# EAGLE design converter in (EAGLE 7.6.0)
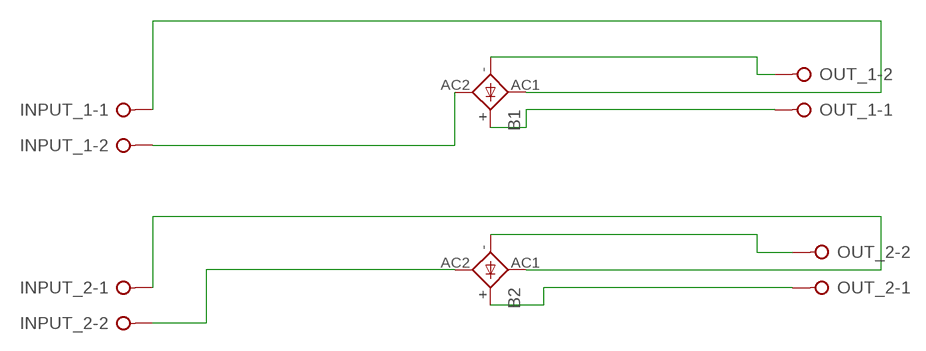
[diagram p0: schematic, sheet 1]

## Parts
B1  2KBP  [2KBP]
B2  2KBP  [2KBP]
INPUT_1  W237-02P  [W237-132]
INPUT_2  W237-02P  [W237-132]
OUT_1  W237-02P  [W237-132]
OUT_2  W237-02P  [W237-132]

## Nets
N$1: B1.- OUT_1.2
N$2: B1.+ OUT_1.1
N$3: B2.- OUT_2.2
N$4: B2.+ OUT_2.1
N$5: B2.AC1 INPUT_2.1
N$6: B2.AC2 INPUT_2.2
N$7: B1.AC2 INPUT_1.2
N$8: B1.AC1 INPUT_1.1

## Library data of the parts
B1 B2 = rectifier:2KBP: RECTIFIER grid 3 x 3,81 mm
INPUT_1 INPUT_2 OUT_1 OUT_2 = con-wago-508:W237-02P: WAGO SREW CLAMP; OC_FARNELL: unknown; OC_NEWARK: unknown

## Net classes
0 default: width 1.524 mm, clearance 0.381 mm

## Board
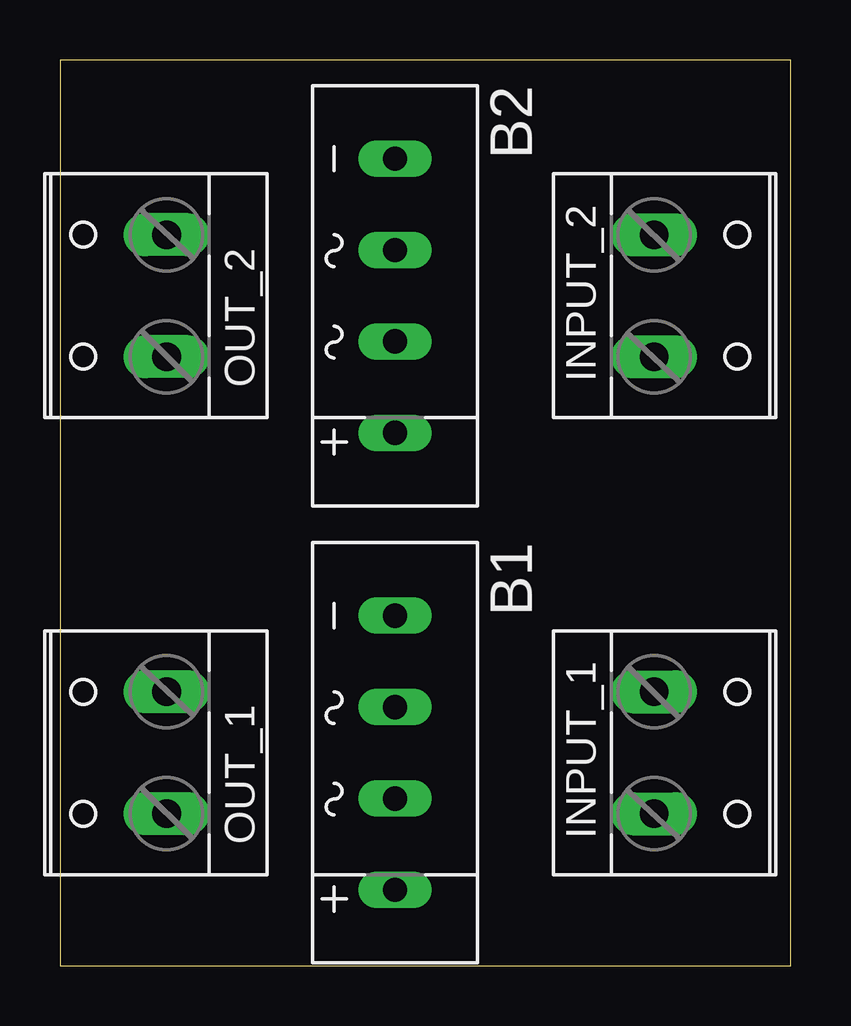
[diagram p1: board, top side]
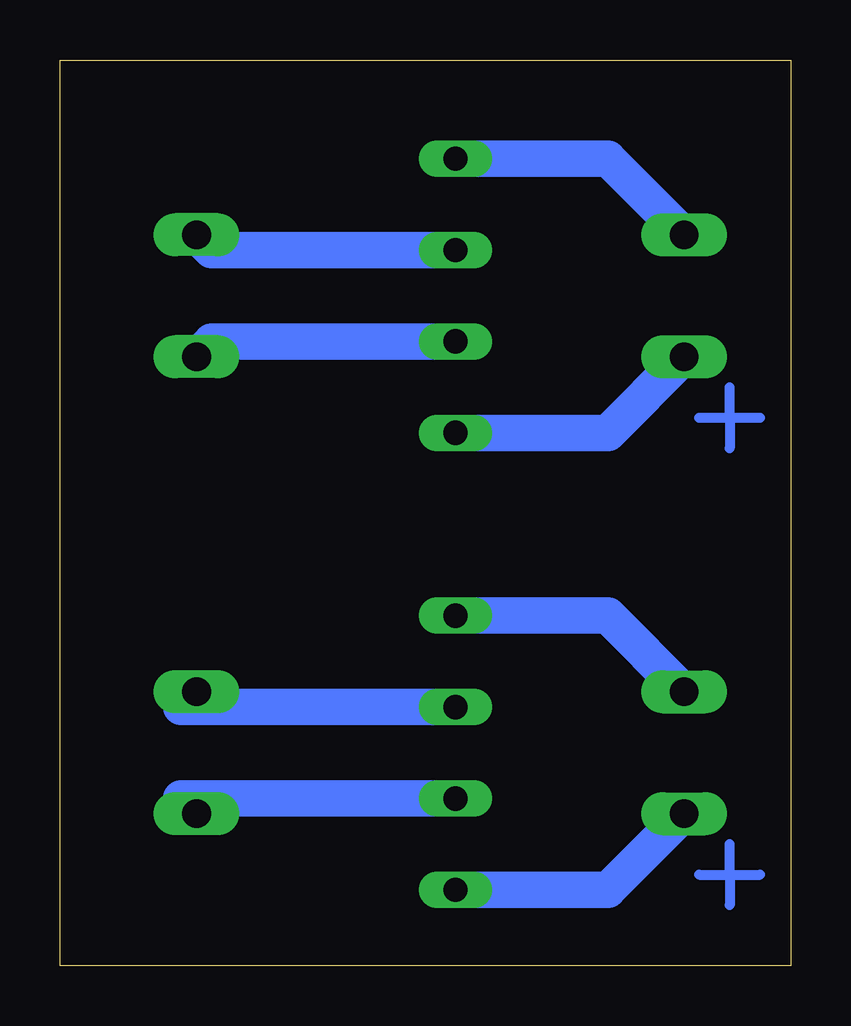
[diagram p2: board, bottom side, seen from below]

Size 30.46 x 37.77 mm. Coordinates in mm from the lower left corner, seen from the top.
Outline: 0,0 30.46,0 30.46,37.77 0,37.77 0,0
Copper layers (1*16): Top 0.035mm / dielectric 1.5mm / Bottom 0.035mm
Design rules "default": minimum track width 10mil, minimum drill 24mil, track to track 8mil, track to pad 8mil, pad to pad 8mil, via to via 8mil, smd to smd 8mil, copper to edge 40mil, drill to drill 8mil, minimum pad ring 10mil, minimum via ring 8mil, stop-mask expansion 4mil, vias tented up to drill 0mil, thermal gap 10mil

### Footprints (pad centres in the part's own frame; a part is rotated, then mirrored left to right if it is on the bottom)
2KBP = drill 1.016 long: + 5.715,0; - -5.715,0; AC1 -1.905,0; AC2 1.905,0
W237-132 = drill 1.194 long: 1 -2.54,-0.635; 2 2.54,-0.635

### Placement (x,y rotation side)
B1  13.97,8.89 270 top
B2  13.97,27.94 270 top
INPUT_1  25.4,8.89 270 top
INPUT_2  25.4,27.94 270 top
OUT_1  3.81,8.89 90 top
OUT_2  3.81,27.94 90 top

### Tracks (layer width: path | path; a pad name or v marks a point on that pad's centre or on a via)
N$1
  Bottom 1.524: B1.- 7.62,14.61 OUT_1.2
N$2
  Bottom 1.524: B1.+ 7.62,3.17 OUT_1.1
N$3
  Bottom 1.524: B2.- 7.62,33.66 OUT_2.2
N$4
  Bottom 1.524: B2.+ 7.62,22.22 OUT_2.1
N$5
  Bottom 1.524: B2.AC1 24.13,29.84 INPUT_2.1
N$6
  Bottom 1.524: B2.AC2 24.13,26.04 INPUT_2.2
N$7
  Bottom 1.524: B1.AC2 25.4,6.98 INPUT_1.2
N$8
  Bottom 1.524: B1.AC1 25.4,10.79 INPUT_1.1
N$9
  Bottom 0.406: 3.81,22.86 2.54,22.86 | 2.54,22.86 1.27,22.86 | 2.54,22.86 2.54,24.13 | 2.54,22.86 2.54,21.59
N$10
  Bottom 0.406: 3.81,3.81 2.54,3.81 | 2.54,3.81 1.27,3.81 | 2.54,3.81 2.54,5.08 | 2.54,3.81 2.54,2.54